# Altium schematic sheet CAN.SchDoc
size A4; SheetNumber: 3; SheetTotal: 7
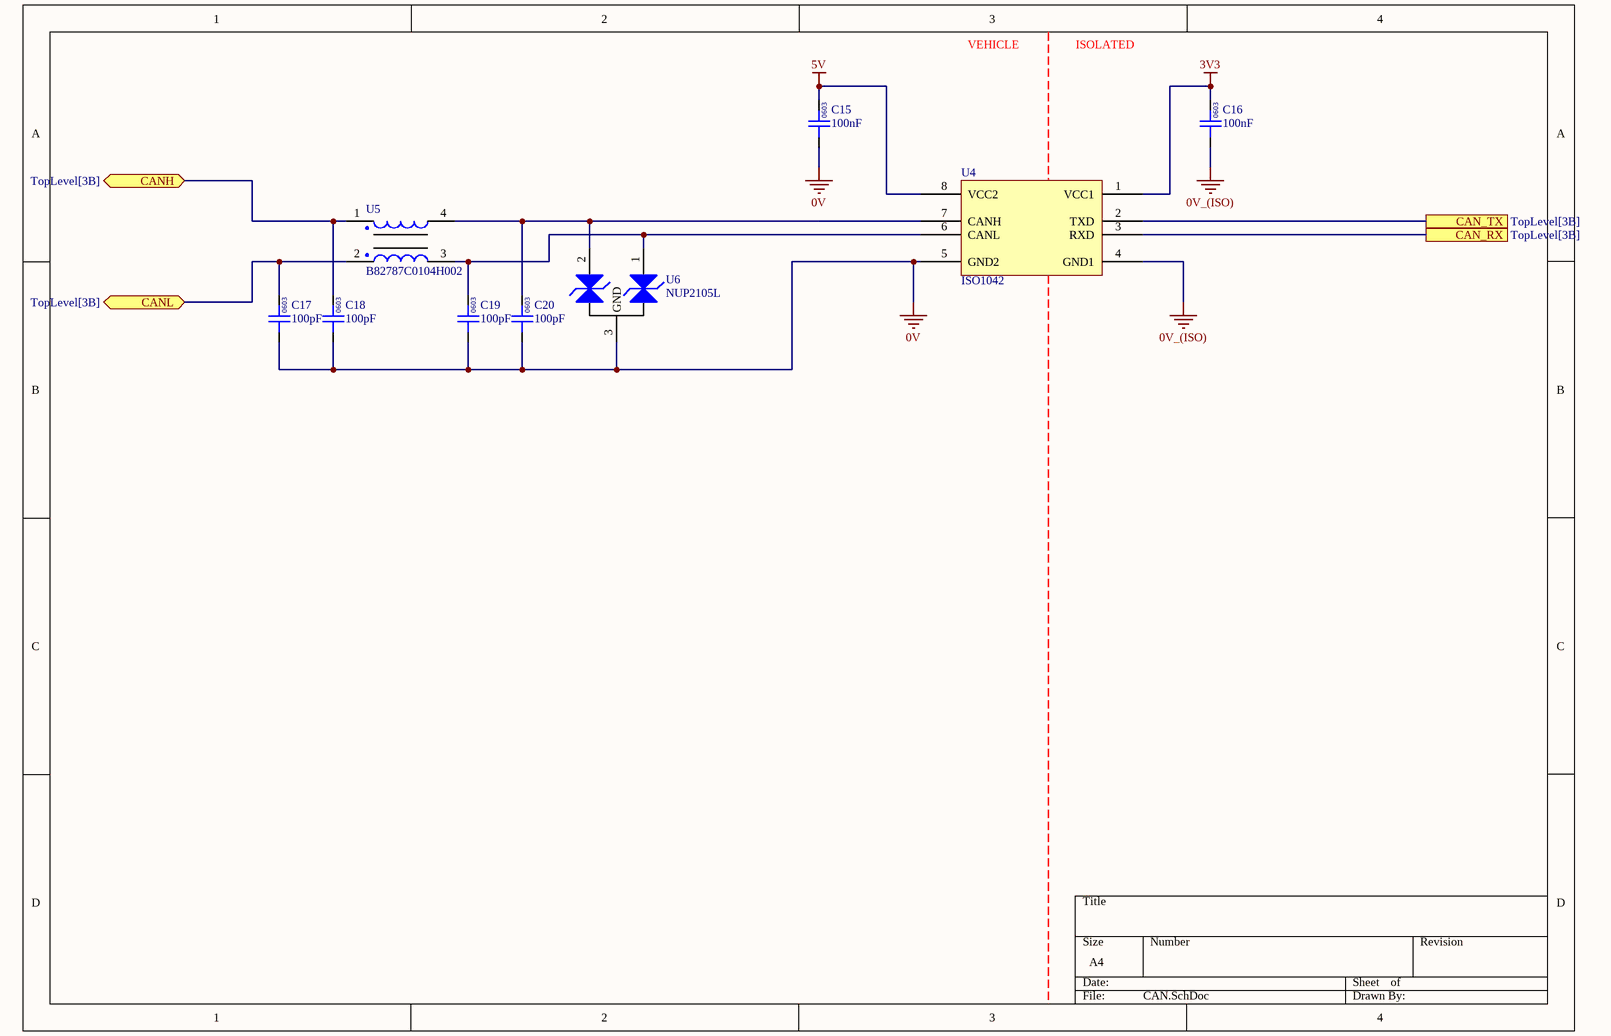
[diagram p0: CAN.SchDoc]

## Parts
C15  100nF  [0603]
C16  100nF  [0603]
C17  100pF  [0603]
C18  100pF  [0603]
C19  100pF  [0603]
C20  100pF  [0603]
U4  ISO1042  [TI-SOIC-8]
U5  B82787C0104H002  [TDK 4-PC Pad]
U6  NUP2105L  [ON SOT-23]

## Ports
CAN_RX (see TopLevel[3B]), CAN_TX (see TopLevel[3B]), CANH (bidir, see TopLevel[3B]), CANL (bidir, see TopLevel[3B])

## Nets
0V: C15.1 C17.1 C18.1 C19.1 C20.1 U4.5(GND2) U6.3(GND)
0V_(ISO): C16.1 U4.4(GND1)
3V3: C16.2 U4.1(VCC1)
5V: C15.2 U4.8(VCC2)
CAN_RX: U4.3(RXD) ; port CAN_RX
CAN_TX: U4.2(TXD) ; port CAN_TX
CANH: C18.2 U5.1 ; port CANH
CANL: C17.2 U5.2 ; port CANL
NetC19_2: C19.2 U4.6(CANL) U5.3 U6.1(CAN_H)
NetC20_2: C20.2 U4.7(CANH) U5.4 U6.2(CAN_L)

## Notes on the sheet
- VEHICLE
- ISOLATED
- (in symbol GCM188L81H104KA57D) 0603
- (in symbol GRM1885C1H101JA01D) 0603

## Library data of the parts
C15 C16 = GCM188L81H104KA57D: Manufacturer: muRata; Rated Voltage: 50V; Tolerance: ±10%; Material: MLCC; Temperature Rating: X8L; Part Number: GCM188L81H104KA57D; Value: 100nF; Digikey Part Number: 490-6049-1-ND
C17-C20 = GRM1885C1H101JA01D: Manufacturer: Murata Electronics; Rated Voltage: 50V; Tolerance: ±5%; Material: MLCC; Temperature Rating: C0G, NP0; Part Number: GRM1885C1H101JA01D; Value: 100pF; Digikey Part Number: 490-1427-1-ND
U4 = ISO1042: IC CAN TRANSCEIVER 1/1 8SOIC; Manufacturer: Texas Instruments; Part Number: ISO1042; Digikey Part Number: 296-ISO1042BQDWVQ1-ND
U5 = B82787C0104H002: Manufacturer: EPCOS (TDK); Value: 100µH @ 100kHz; Impedance: 5.8 kOhms @ 10MHz; Rated Current: 150mA; Part Number: B82787C0104H002; Material: Wirewound; Digikey Part Number: 495-4598-1-ND
U6 = NUP2105L: Dual Line CAN Bus Protector; Manufacturer: ON Semiconductor; Part Number: NUP2105L; Digikey Part Number: NUP2105LT1GOSCT-ND; Digikey Link: https://www.digikey.com/product-detail/en/on-semiconductor/NUP2105LT1G/NUP2105LT1GOSCT-ND/1485001